# Altium schematic sheet Roessler.SchDoc
size A4; Organization: Technokrat; Address1: 3 Minna Close; Address2: Belrose; Address3: NSW 2085; Address4: Australia; SheetNumber: 6; SheetTotal: 10
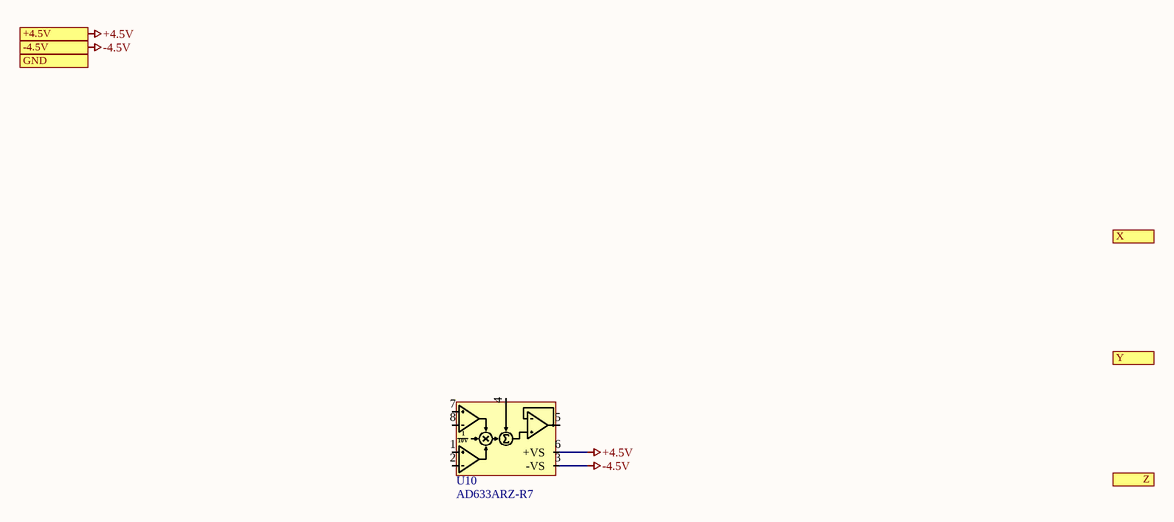
[diagram p0: Roessler.SchDoc]

## Parts
U10  AD633ARZ-R7  [SO8_1.27_C]

## Ports
+4.5V, -4.5V, GND, X (out), Y (out), Z (out)

## Nets
+4.5V: U10.6(+VS) ; port +4.5V
-4.5V: U10.3(-VS) ; port -4.5V

Not connected (* = marked no-connect by the designer): U10 1(Y1) 2(Y2) 4(Z) 5(W) 7(X1) 8(X2)

## Notes on the sheet
- Rev:
- /
- File:
- (in symbol AD633AR-R7) 10V

## Library data of the parts
U10 = AD633AR-R7: Analog Multiplier 4-Quadrant 8-SOIC; Type: AD633ARZ-R7; Supplier 1: Arrow Electronics; Supplier Part Number 1: AD633ARZ-R7